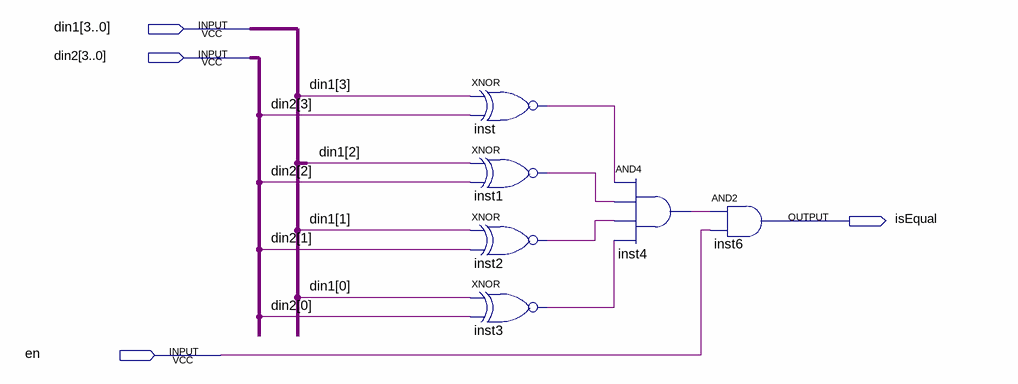
[diagram p0: schematic sheet]
// Quartus schematic cmp_4bit.bdf as structural Verilog: 6 symbols, 4 pins
module cmp_4bit (
  input  [3:0] din1,
  input  [3:0] din2,
  input  en,
  output isEqual
);

  wire inst1_out, inst2_out, inst3_out, inst4_out, inst_out;

  xnor inst (inst_out, din1[3], din2[3]);
  xnor inst1 (inst1_out, din1[2], din2[2]);
  xnor inst2 (inst2_out, din1[1], din2[1]);
  xnor inst3 (inst3_out, din1[0], din2[0]);
  and inst4 (inst4_out, inst_out, inst1_out, inst2_out, inst3_out);
  and inst6 (isEqual, inst4_out, en);
endmodule
